# Altium schematic sheet Hierarchical Schematic.SchDoc
size A4 portrait; SheetNumber: 1; SheetTotal: 3
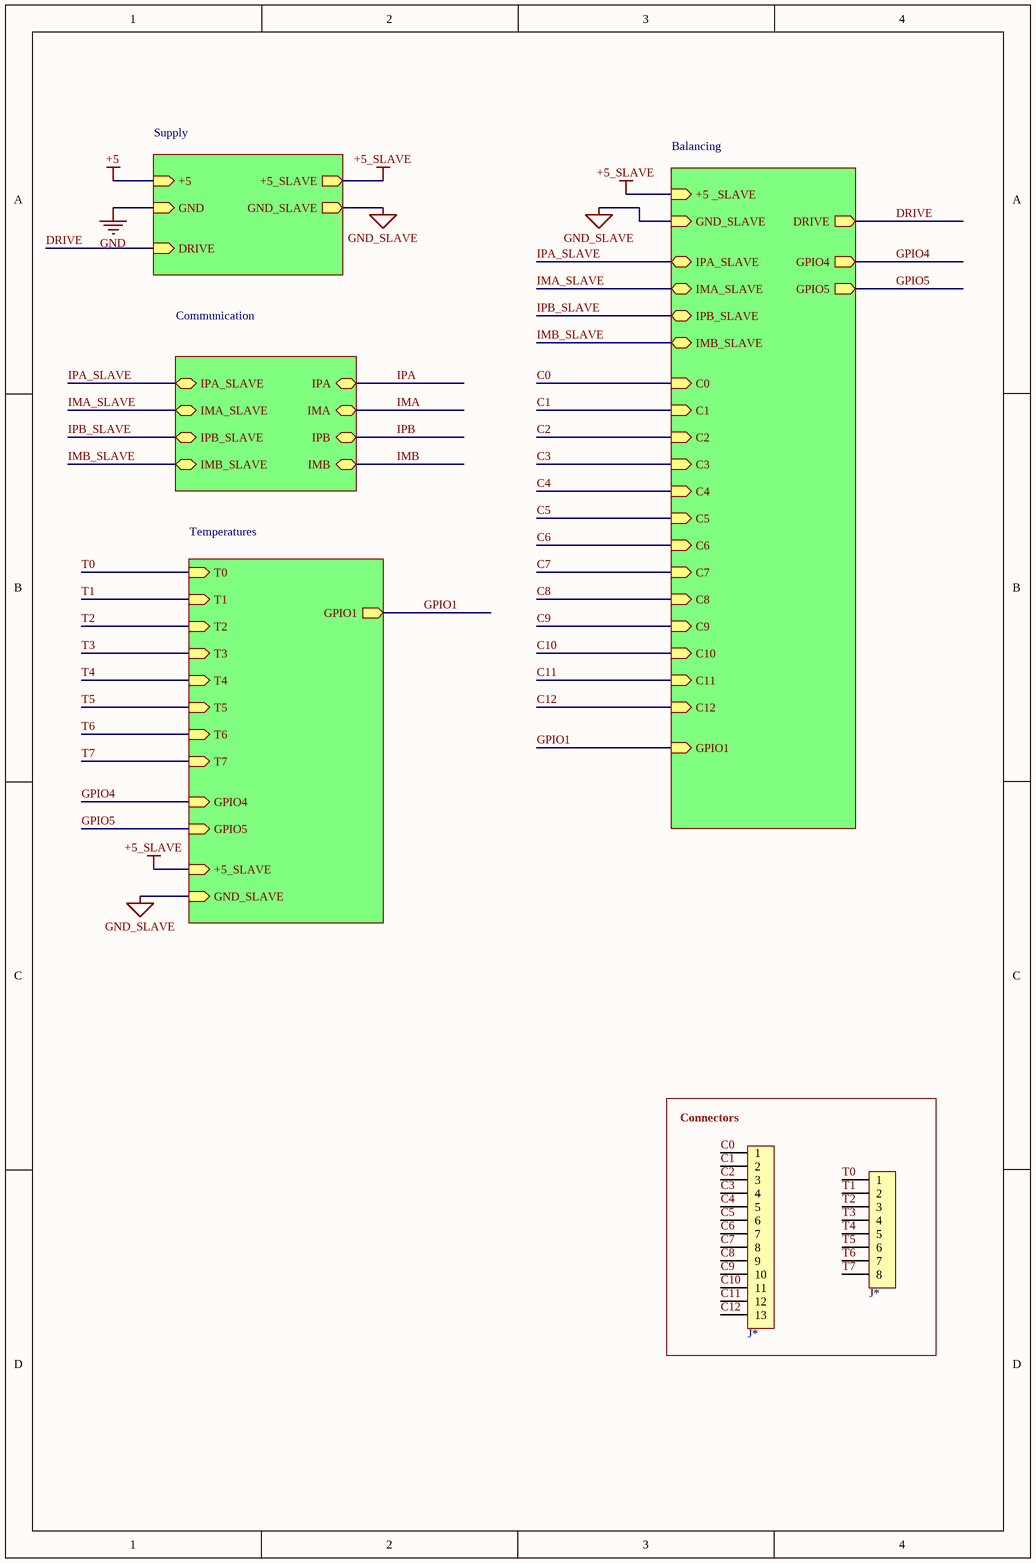
[diagram p0: Hierarchical Schematic.SchDoc]

## Parts
(Parts that share a designator on the sheet are numbered #1, #2 ... from top to bottom, then left to right.)
J*#1  61301211121  [J_Pinheader_1x13]  (value not drawn)
J*#2  61301211121  [J_Pinheader_1x8]  (value not drawn)

## Blocks framed on the sheet
Connectors: J*#1 J*#2

## Sub-sheets
Balancing = Balanciing: GND_SLAVE (in), +5 _SLAVE (in), IPA_SLAVE (bidir), IMA_SLAVE (bidir), IPB_SLAVE (bidir), IMB_SLAVE (bidir), DRIVE (out), GPIO1 (in), GPIO4 (out), GPIO5 (out), C0 (in), C1 (in), C2 (in), C3 (in), C4 (in), C5 (in), C6 (in), C7 (in), C8 (in), C9 (in), C10 (in), C11 (in), C12 (in)
Communication = File Name: IPA_SLAVE (bidir), IMA_SLAVE (bidir), IPB_SLAVE (bidir), IMB_SLAVE (bidir), IPA (bidir), IMA (bidir), IPB (bidir), IMB (bidir)
Supply = Supply: GND (in), +5 (in), GND_SLAVE (out), +5_SLAVE (out), DRIVE (in)
Temperatures = File Name: T0 (in), T2 (in), T3 (in), T4 (in), T6 (in), T7 (in), T5 (in), T1 (in), GPIO5 (in), GPIO4 (in), GPIO1 (out), +5_SLAVE (in), GND_SLAVE (in)

## Nets
+5: sheet Supply/+5
+5_SLAVE: sheet Supply/+5_SLAVE, sheet Balancing/+5 _SLAVE, sheet Temperatures/+5_SLAVE
GND: sheet Supply/GND
GND_SLAVE: sheet Supply/GND_SLAVE, sheet Balancing/GND_SLAVE, sheet Temperatures/GND_SLAVE
C0: J*#1.1 ; sheet Balancing/C0
C1: J*#1.2 ; sheet Balancing/C1
C2: J*#1.3 ; sheet Balancing/C2
C3: J*#1.4 ; sheet Balancing/C3
C4: J*#1.5 ; sheet Balancing/C4
C5: J*#1.6 ; sheet Balancing/C5
C6: J*#1.7 ; sheet Balancing/C6
C7: J*#1.8 ; sheet Balancing/C7
C8: J*#1.9 ; sheet Balancing/C8
C9: J*#1.10 ; sheet Balancing/C9
C10: J*#1.11 ; sheet Balancing/C10
C11: J*#1.12 ; sheet Balancing/C11
C12: J*#1.13 ; sheet Balancing/C12
DRIVE: sheet Supply/DRIVE, sheet Balancing/DRIVE
GPIO1: sheet Balancing/GPIO1, sheet Temperatures/GPIO1
GPIO4: sheet Balancing/GPIO4, sheet Temperatures/GPIO4
GPIO5: sheet Balancing/GPIO5, sheet Temperatures/GPIO5
IMA: sheet Communication/IMA
IMA_SLAVE: sheet Balancing/IMA_SLAVE, sheet Communication/IMA_SLAVE
IMB: sheet Communication/IMB
IMB_SLAVE: sheet Balancing/IMB_SLAVE, sheet Communication/IMB_SLAVE
IPA: sheet Communication/IPA
IPA_SLAVE: sheet Balancing/IPA_SLAVE, sheet Communication/IPA_SLAVE
IPB: sheet Communication/IPB
IPB_SLAVE: sheet Balancing/IPB_SLAVE, sheet Communication/IPB_SLAVE
T0: J*#2.1 ; sheet Temperatures/T0
T1: J*#2.2 ; sheet Temperatures/T1
T2: J*#2.3 ; sheet Temperatures/T2
T3: J*#2.4 ; sheet Temperatures/T3
T4: J*#2.5 ; sheet Temperatures/T4
T5: J*#2.6 ; sheet Temperatures/T5
T6: J*#2.7 ; sheet Temperatures/T6
T7: J*#2.8 ; sheet Temperatures/T7

## Library data of the parts
J*#1 = J_Pinheader_1x13: THT Vertical Pin Header WR-PHD, Pitch 2.54 mm, Single Row, 13 pins; Manufacturer 1: Wurth Electronics; Number of Positions: 12; Gender: Male; Connector Type: Male Pin; Pitch: 0.1inch; Supplier 1: Digi-Key; Manufacturer Part Number 1: 61301211121; RoHS: Yes; Category: Connectors; Stock 1: 2124; Pricing 1: 1=0,57000, 10=0,48400, 25=0,40400, 50=0,33700, 100=0,30600, 1000=0,27800 (USD); Mount: Through Hole; Contact Plating: Gold; Contact Material: Copper; Color: Black; Number of Rows: 1; Packaging: Bulk; Termination: Solder; Number of Contacts: 12; Contact Mating Length: 0.236inch; REACH SVHC: Unknown; RoHS Compliant: Yes; ComponentLink1URL: http://www.farnell.com/cad/1737268.pdf?src-supplier=Element14; ComponentLink1Description: http://www.farnell.com/cad/1737268.pdf?src-supplier=Element14; ComponentLink2URL: https://katalog.we-online.de/em/datasheet/6130xx11121.pdf?src-supplier=Digi-Key; ComponentLink2Description: https://katalog.we-online.de/em/datasheet/6130xx11121.pdf?src-supplier=Digi-Key
J*#2 = J_Pinheader_1x8: THT Vertical Pin Header WR-PHD, Pitch 2.54 mm, Single Row, 12 pins; Manufacturer 1: Wurth Electronics; Number of Positions: 12; Gender: Male; Connector Type: Male Pin; Pitch: 0.1inch; Supplier 1: Digi-Key; Manufacturer Part Number 1: 61301211121; RoHS: Yes; Category: Connectors; Stock 1: 2124; Pricing 1: 1=0,57000, 10=0,48400, 25=0,40400, 50=0,33700, 100=0,30600, 1000=0,27800 (USD); Mount: Through Hole; Contact Plating: Gold; Contact Material: Copper; Color: Black; Number of Rows: 1; Packaging: Bulk; Termination: Solder; Number of Contacts: 12; Contact Mating Length: 0.236inch; REACH SVHC: Unknown; RoHS Compliant: Yes; ComponentLink1URL: http://www.farnell.com/cad/1737268.pdf?src-supplier=Element14; ComponentLink1Description: http://www.farnell.com/cad/1737268.pdf?src-supplier=Element14; ComponentLink2URL: https://katalog.we-online.de/em/datasheet/6130xx11121.pdf?src-supplier=Digi-Key; ComponentLink2Description: https://katalog.we-online.de/em/datasheet/6130xx11121.pdf?src-supplier=Digi-Key